# Altium schematic sheet SH2 - MCU.SchDoc: Microcontroller
size B; CheckedBy: Lance Bantoto; Engineer: Christopher Arjune; Organization: UW Robotics; Address1: 200 University Avenue; Address2: Waterloo; Address3: Ontario; Address4: Canada N2L 3G6; Revision: 1; SheetNumber: 2; SheetTotal: 6
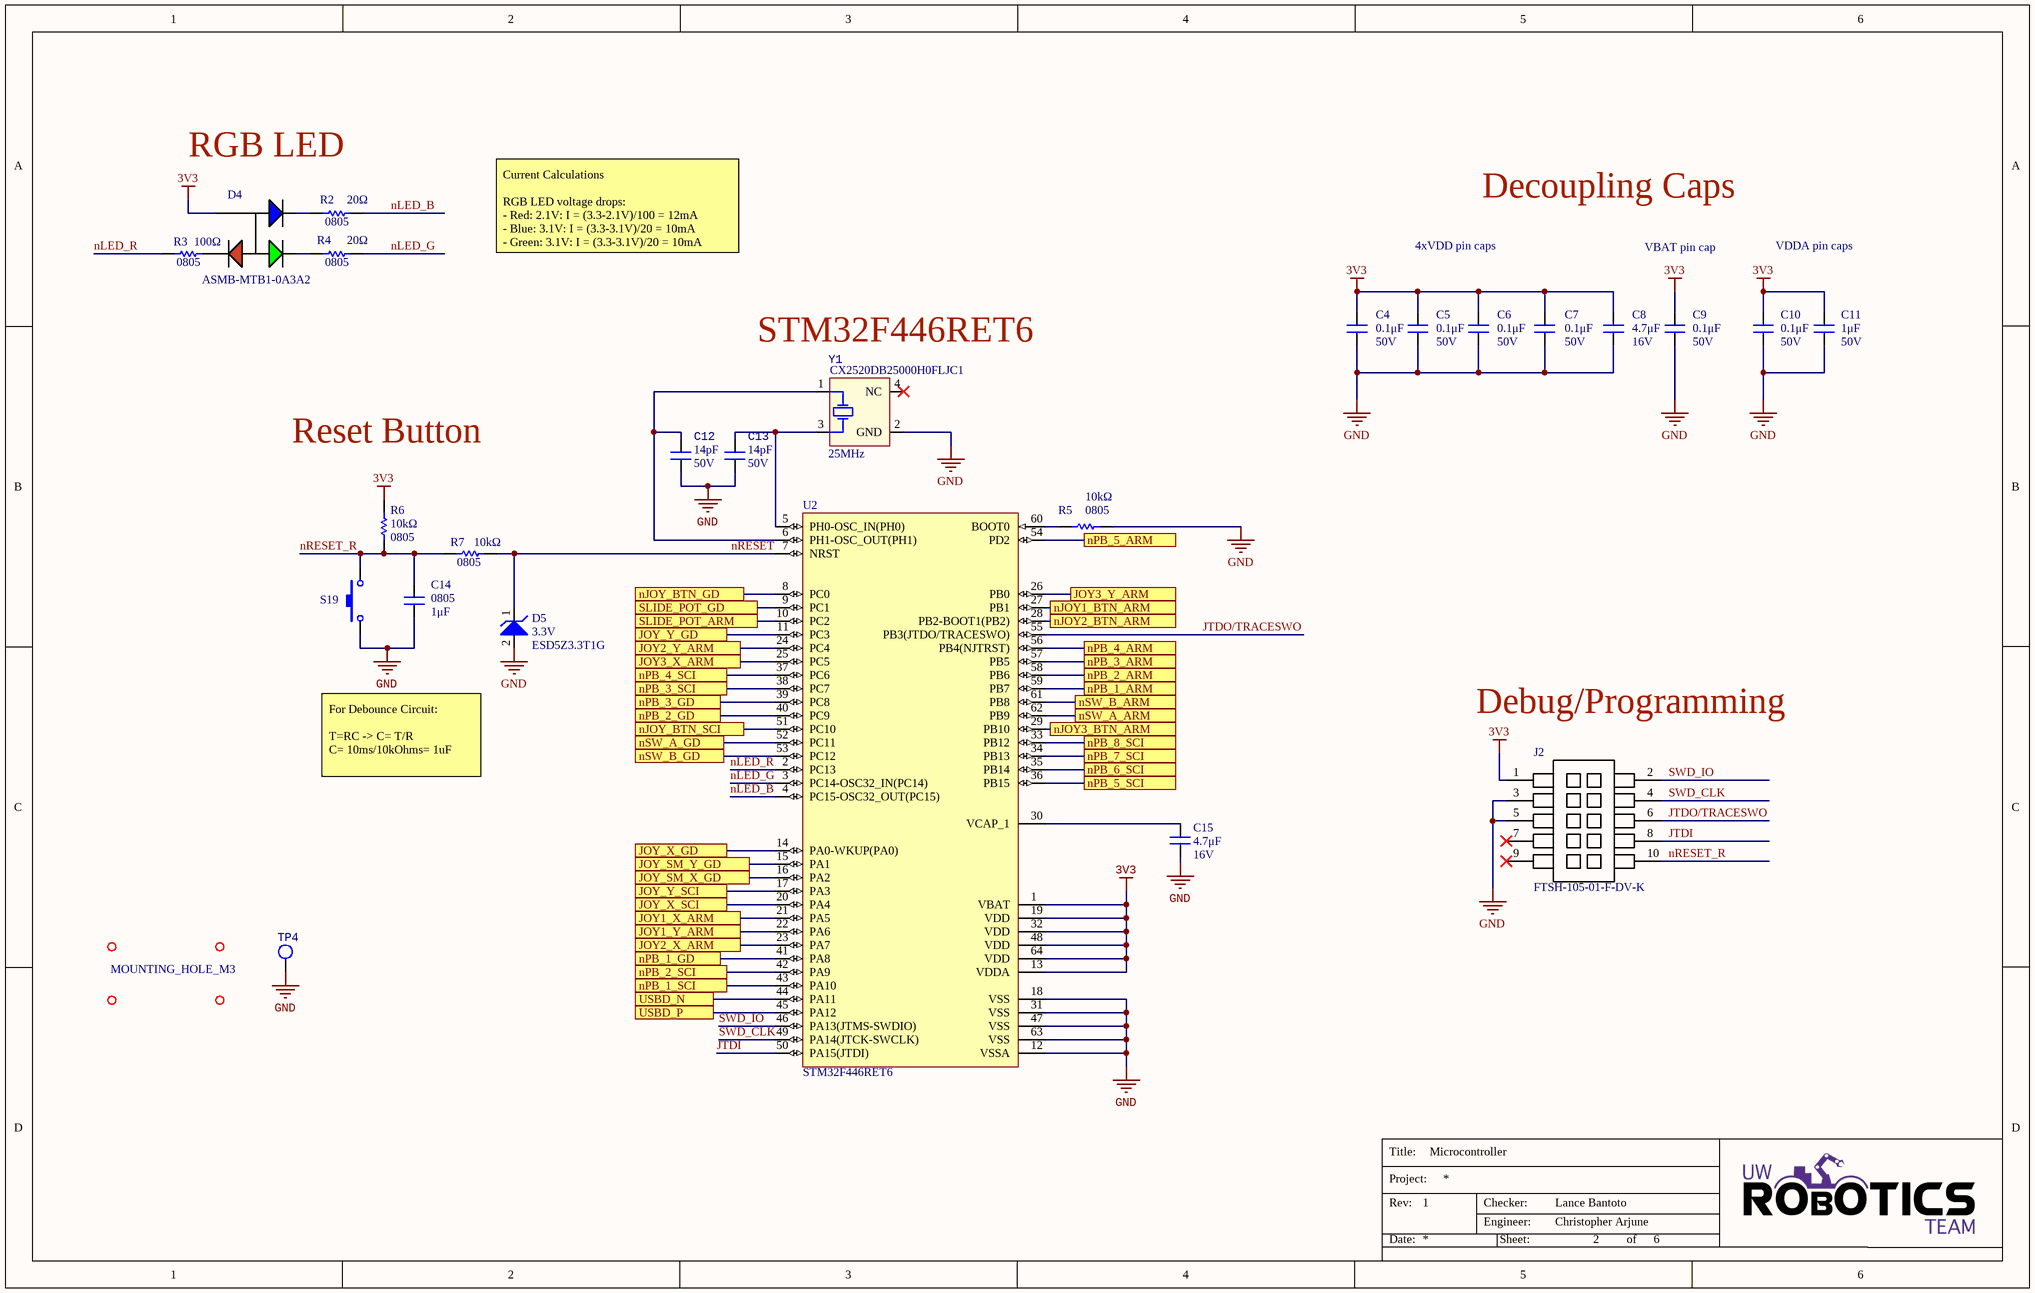
[diagram p0: SH2 - MCU.SchDoc]

## Parts
C4  value 0.1μF  Voltage Rating: 50V  [CAP2012]  (hidden comment: CAP_0.1uF_50V_0805)
C5  value 0.1μF  Voltage Rating: 50V  [CAP2012]  (hidden comment: CAP_0.1uF_50V_0805)
C6  value 0.1μF  Voltage Rating: 50V  [CAP2012]  (hidden comment: CAP_0.1uF_50V_0805)
C7  value 0.1μF  Voltage Rating: 50V  [CAP2012]  (hidden comment: CAP_0.1uF_50V_0805)
C8  value 4.7μF  Voltage Rating: 16V  [CAP2012]  (hidden comment: CAP_4.7uF_16V_0805)
C9  value 0.1μF  Voltage Rating: 50V  [CAP2012]  (hidden comment: CAP_0.1uF_50V_0805)
C10  value 0.1μF  Voltage Rating: 50V  [CAP2012]  (hidden comment: CAP_0.1uF_50V_0805)
C11  value 1μF  Voltage Rating: 50V  [CAP2012]  (hidden comment: CAP_1uF_50V_0805)
C12  value 14pF  Voltage Rating: 50V  [CAP0603]  (hidden comment: CAP_14pF_50V_0603)
C13  value 14pF  Voltage Rating: 50V  [CAP0603]  (hidden comment: CAP_14pF_50V_0603)
C14  value 1μF  Package/Footprint: 0805  [CAP2012]  (hidden comment: CAP_1uF_50V_0805)
C15  value 4.7μF  Voltage Rating: 16V  [CAP2012]  (hidden comment: CAP_4.7uF_16V_0805)
D4  Manufacturer Part Number 1: ASMB-MTB1-0A3A2  [LED_RGB]  (hidden comment: LED_RGB)
D5  Manufacturer Part Number 1: ESD5Z3.3T1G  Voltage - Reverse Standoff (Typ): 3.3V  (hidden comment: TVS_DIODE_UNIDIR_3.3V)
J2  Manufacturer Part Number 1: FTSH-105-01-F-DV-K  [FTSH-105-01-F-DV-K-P-TR]  (hidden comment: CON_PROGRAMMING)
MH1  MOUNTING_HOLE_M3  [MOUNTING_HOLE_3mm]  (value not drawn)  (no BOM)
MH2  MOUNTING_HOLE_M3  [MOUNTING_HOLE_3mm]  (value not drawn)  (no BOM)
MH3  MOUNTING_HOLE_M3  [MOUNTING_HOLE_3mm]  (no BOM)
MH4  MOUNTING_HOLE_M3  [MOUNTING_HOLE_3mm]  (value not drawn)  (no BOM)
R2  value 20Ω  Package/Footprint: 0805  [RESC0805]  (hidden comment: RES_20Ω_0805_1%)
R3  value 100Ω  Package/Footprint: 0805  [RESC0805]  (hidden comment: RES_100Ω_0805_1%)
R4  value 20Ω  Package/Footprint: 0805  [RESC0805]  (hidden comment: RES_20Ω_0805_1%)
R5  value 10kΩ  Package/Footprint: 0805  [RESC0805]  (hidden comment: RES_10kΩ_0805_5%)
R6  value 10kΩ  Package/Footprint: 0805  [RESC0805]  (hidden comment: RES_10kΩ_0805_5%)
R7  value 10kΩ  Package/Footprint: 0805  [RESC0805]  (hidden comment: RES_10kΩ_0805_5%)
S19  SW_TACTILE  [B3U-1000P]  (value not drawn)
TP4  TESTPOINT_LOOP  [TESTPOINT_LOOP]  (value not drawn)
U2  STM32F446RET6  [STM-LQFP64_L]
Y1  Manufacturer Part Number 1: CX2520DB25000H0FLJC1  Frequency: 25MHz  [SOIC254P1016X440-4N]  (hidden comment: CRYSTAL_25MHZ)

## Ports
JOY1_X_ARM, JOY1_Y_ARM, JOY2_X_ARM, JOY2_Y_ARM, JOY3_X_ARM, JOY3_Y_ARM, JOY_SM_X_GD, JOY_SM_Y_GD, JOY_X_GD, JOY_X_SCI, JOY_Y_GD, JOY_Y_SCI, nJOY1_BTN_ARM, nJOY2_BTN_ARM, nJOY3_BTN_ARM, nJOY_BTN_GD, nJOY_BTN_SCI, nPB_1_ARM, nPB_1_GD, nPB_1_SCI, nPB_2_ARM, nPB_2_GD, nPB_2_SCI, nPB_3_ARM, nPB_3_GD, nPB_3_SCI, nPB_4_ARM, nPB_4_SCI, nPB_5_ARM, nPB_5_SCI, nPB_6_SCI, nPB_7_SCI, nPB_8_SCI, nSW_A_ARM, nSW_A_GD, nSW_B_ARM, nSW_B_GD, SLIDE_POT_ARM, SLIDE_POT_GD, USBD_N, USBD_P

## Nets
3V3: C4.2 C5.2 C6.2 C7.2 C8.2 C9.2 C10.2 C11.2 D4.4(COMMON_ANODE) J2.1 R6.2 U2.1(VBAT) U2.13(VDDA) U2.19(VDD) U2.32(VDD) U2.48(VDD) U2.64(VDD)
GND: C4.1 C5.1 C6.1 C7.1 C8.1 C9.1 C10.1 C11.1 C12.1 C13.1 C14.1 C15.1 D5.2 J2.3 J2.5 R5.2 S19.2 TP4.1 U2.12(VSSA) U2.18(VSS) U2.31(VSS) U2.47(VSS) U2.63(VSS) Y1.2(GND)
JOY1_X_ARM: U2.21(PA5) ; port JOY1_X_ARM
JOY1_Y_ARM: U2.22(PA6) ; port JOY1_Y_ARM
JOY2_X_ARM: U2.23(PA7) ; port JOY2_X_ARM
JOY2_Y_ARM: U2.24(PC4) ; port JOY2_Y_ARM
JOY3_X_ARM: U2.25(PC5) ; port JOY3_X_ARM
JOY3_Y_ARM: U2.26(PB0) ; port JOY3_Y_ARM
JOY_SM_X_GD: U2.16(PA2) ; port JOY_SM_X_GD
JOY_SM_Y_GD: U2.15(PA1) ; port JOY_SM_Y_GD
JOY_X_GD: U2.14(PA0-WKUP(PA0)) ; port JOY_X_GD
JOY_X_SCI: U2.20(PA4) ; port JOY_X_SCI
JOY_Y_GD: U2.11(PC3) ; port JOY_Y_GD
JOY_Y_SCI: U2.17(PA3) ; port JOY_Y_SCI
JTDI: J2.8 U2.50(PA15(JTDI))
JTDO/TRACESWO: J2.6 U2.55(PB3(JTDO/TRACESWO))
nJOY1_BTN_ARM: U2.27(PB1) ; port nJOY1_BTN_ARM
nJOY2_BTN_ARM: U2.28(PB2-BOOT1(PB2)) ; port nJOY2_BTN_ARM
nJOY3_BTN_ARM: U2.29(PB10) ; port nJOY3_BTN_ARM
nJOY_BTN_GD: U2.8(PC0) ; port nJOY_BTN_GD
nJOY_BTN_SCI: U2.51(PC10) ; port nJOY_BTN_SCI
nLED_B: R2.2 U2.4(PC15-OSC32_OUT(PC15))
nLED_G: R4.2 U2.3(PC14-OSC32_IN(PC14))
nLED_R: R3.1 U2.2(PC13)
nPB_1_ARM: U2.59(PB7) ; port nPB_1_ARM
nPB_1_GD: U2.41(PA8) ; port nPB_1_GD
nPB_1_SCI: U2.43(PA10) ; port nPB_1_SCI
nPB_2_ARM: U2.58(PB6) ; port nPB_2_ARM
nPB_2_GD: U2.40(PC9) ; port nPB_2_GD
nPB_2_SCI: U2.42(PA9) ; port nPB_2_SCI
nPB_3_ARM: U2.57(PB5) ; port nPB_3_ARM
nPB_3_GD: U2.39(PC8) ; port nPB_3_GD
nPB_3_SCI: U2.38(PC7) ; port nPB_3_SCI
nPB_4_ARM: U2.56(PB4(NJTRST)) ; port nPB_4_ARM
nPB_4_SCI: U2.37(PC6) ; port nPB_4_SCI
nPB_5_ARM: U2.54(PD2) ; port nPB_5_ARM
nPB_5_SCI: U2.36(PB15) ; port nPB_5_SCI
nPB_6_SCI: U2.35(PB14) ; port nPB_6_SCI
nPB_7_SCI: U2.34(PB13) ; port nPB_7_SCI
nPB_8_SCI: U2.33(PB12) ; port nPB_8_SCI
nRESET: D5.1 R7.2 U2.7(NRST)
nRESET_R: C14.2 J2.10 R6.1 R7.1 S19.1
nSW_A_ARM: U2.62(PB9) ; port nSW_A_ARM
nSW_A_GD: U2.52(PC11) ; port nSW_A_GD
nSW_B_ARM: U2.61(PB8) ; port nSW_B_ARM
nSW_B_GD: U2.53(PC12) ; port nSW_B_GD
SLIDE_POT_ARM: U2.10(PC2) ; port SLIDE_POT_ARM
SLIDE_POT_GD: U2.9(PC1) ; port SLIDE_POT_GD
SWD_CLK: J2.4 U2.49(PA14(JTCK-SWCLK))
SWD_IO: J2.2 U2.46(PA13(JTMS-SWDIO))
USBD_N: U2.44(PA11) ; port USBD_N
USBD_P: U2.45(PA12) ; port USBD_P
NetC12_2: C12.2 U2.6(PH1-OSC_OUT(PH1)) Y1.1(HOT)
NetC13_2: C13.2 U2.5(PH0-OSC_IN(PH0)) Y1.3(HOT)
NetC15_2: C15.2 U2.30(VCAP_1)
NetD4_1: D4.1(CATHODE_(RED)) R3.2
NetD4_2: D4.2(CATHODE_(GREEN)) R4.1
NetD4_3: D4.3(CATHODE_(BLUE)) R2.1
NetR5_1: R5.1 U2.60(BOOT0)

Not connected (* = marked no-connect by the designer): J2 7* 9*; Y1 4(NC)*

## Notes on the sheet
- RGB LED
- Decoupling Caps
- Current Calculations
  RGB LED voltage drops:
  - Red: 2.1V: I = (3.3-2.1V)/100 = 12mA
  - Blue: 3.1V: I = (3.3-3.1V)/20 = 10mA
  - Green: 3.1V: I = (3.3-3.1V)/20 = 10mA
- 4xVDD pin caps
- VBAT pin cap
- VDDA pin caps
- (near Y1) STM32F446RET6
- Reset Button
- For Debounce Circuit:
  T=RC -> C= T/R
  C= 10ms/10kOhms= 1uF
- Debug/Programming
- Title:
- Project:
- Date:
- Rev:
- Checker:
- Engineer:
- Sheet:
- of

## Library data of the parts
C4-C7 C9 C10 = CAP_0.1uF_50V_0805: CAP CER 0.1UF 50V X7R 0805; Manufacturer 1: Murata Electronics; Manufacturer Part Number 1: GCM21BR71H104KA37K; Package/Footprint: 0805; Supplier 1: Digi-Key; Supplier Part Number 1: 490-8049-1-ND; Mounting Type: SMD; LCSC Part #: C49678; Dielectric: X7R
C8 C15 = CAP_4.7uF_16V_0805: CAP CER 4.7UF 16V X5R 0805; Manufacturer 1: Samsung Electro-Mechanics; Manufacturer Part Number 1: CL21A475KOFNNNE; Package/Footprint: 0805; Supplier 1: Digi-Key; Supplier Part Number 1: 1276-1065-1-ND; Mounting Type: SMD; LCSC Part #: C1779; Dielectric: X5R
C11 = CAP_1uF_50V_0805: CAP CER 1UF 50V X7R 0805; Manufacturer 1: Samsung Electro-Mechanics; Manufacturer Part Number 1: CL21B105KBFNNNG; Package/Footprint: 0805; Supplier 1: Digi-Key; Supplier Part Number 1: 1276-6470-1-ND; Mounting Type: SMD; LCSC Part #: C28323
C12 C13 = CAP_14pF_50V_0603: CAP CER 14PF 50V C0G/NP0 0603; Manufacturer 1: Samsung; Manufacturer Part Number 1: CL10C140JB8NNNC; Dielectric: C0G; Package/Footprint: 0603; Supplier Part Number 1: 1276-2187-1-ND; Supplier 1: Digi-Key; Mounting Type: SMD
C14 = CAP_1uF_50V_0805: CAP CER 1UF 50V X7R 0805; Manufacturer 1: Samsung Electro-Mechanics; Manufacturer Part Number 1: CL21B105KBFNNNG; Supplier 1: Digi-Key; Supplier Part Number 1: 1276-6470-1-ND; Voltage Rating: 50V; Mounting Type: SMD; LCSC Part #: C28323
D4 = LED_RGB: LED RGB DIFFUSED 4PLCC SMD; Manufacturer 1: Broadcom; Color: Blue,Green,Red; Lens Color: White; Viewing Angle: 115°; Lens Style: Round; Luminous Intensity: 350mcd; Dominant Wavelength: 470nm; Forward Voltage: 3.1V; Test Current: 20mA; Package/Footprint: 4-PLCC; Supplier 1: Digi-Key; Number of Pins: 4; Lens Transparency: Diffused; Supplier Part Number 1: 516-3280-1-ND; Mounting Type: SMD
D5 = TVS_DIODE_UNIDIR_3.3V: TVS DIODE 3.3V 14.1V SOD523; Manufacturer 1: ON Semiconductor; Package/Footprint: SOD-523; Voltage - Breakdown (Min): 5V; Supplier 1: Digi-Key; Supplier Part Number 1: ESD5Z3.3T1GOSCT-ND; Mounting Type: SMD; LCSC Part #: C61148; Voltage - Clamping (Max) @ Ipp: 14.1V
J2 = CON_PROGRAMMING: CONN HEADER SMD 10POS 1.27MM; Manufacturer 1: Samtec; Supplier 1: Digi-Key; Pitch: 1.27mm; Supplier Part Number 1: SAM8796-ND; Mounting Type: SMD; Package/Footprint: SMD
R2 R4 = RES_20Ω_0805_1%: RES 20 OHM 1% 1/8W 0805; Manufacturer 1: Yageo; Manufacturer Part Number 1: RC0805FR-0720RL; Supplier 1: Digi-Key; Supplier Part Number 1: 311-20.0CRCT-ND; Mounting Type: SMD; LCSC Part #: C17581
R3 = RES_100Ω_0805_1%: RES 100 OHM 1% 1/8W 0805; Manufacturer 1: Vishay Dale; Manufacturer Part Number 1: CRCW0805100RFKEA; Supplier 1: Digi-Key; Supplier Part Number 1: 541-100CCT-ND; Mounting Type: SMD; LCSC Part #: C1790
R5-R7 = RES_10kΩ_0805_5%: RES 10K OHM 5% 1/8W 0805; Manufacturer 1: Panasonic Electronic Components; Manufacturer Part Number 1: ERJ-6GEYJ103V; Supplier 1: Digi-Key; Supplier Part Number 1: P10KACT-ND; LCSC Part #: C17414; Mounting Type: SMD
S19 = SW_TACTILE: SWITCH TACTILE SPST-NO 0.05A 12V; Manufacturer 1: Omron Electronics Inc-EMC Div; Package/Footprint: SMD; Manufacturer Part Number 1: B3U-1000P; Supplier 1: Digi-Key; Supplier Part Number 1: SW1020CT-ND; Mounting Type: SMD
TP4 = TESTPOINT_LOOP: TESTPOINT THRUHOLE; Manufacturer Part Number 1: 5002; Manufacturer 1: Keystone Electronics; Package/Footprint: TH; Supplier Part Number 1: 36-5002-ND; Supplier 1: Digi-Key; Mounting Type: TH
U2 = MCU_STM32F446RET6: ARM Cortex-M4 32-bit MCU+FPU, 512 KB Flash, 128 KB Internal RAM, 50 I/Os, 64-Pin LQFP, -40 to 85 degC, Tray; I/Os (High Current): 50; Supply Voltage(Vcc) min (V): 1.7; Operating Frequency(F) (Processor speed) (MHz): 180; D/A Converter: 2; Internal RAM Size (kB): 128; FLASH Size (Prog) (kB): 512; Core: ARM Cortex-M4; ComponentLink1Description: Manufacturer URL; Package Reference: 64-Pin Low-profile Quad Flat Package, Body 10 x 10 mm, Pitch 0.5 mm; ComponentLink2URL: http://www.st.com/st-web-ui/static/active/en/resource/technical/document/datasheet/DM00141306.pdf; Packing: Tray; DatasheetVersion: Rev. 6; ComponentLink1URL: http://www.st.com/; ComponentLink2Description: Datasheet; Package Description: LQFP64; Mounting Technology: Surface Mount; Supplier Part Number 1: 497-15376-ND; Supplier 1: Digi-Key
Y1 = CRYSTAL_25MHZ: CRYSTAL 25.0000MHZ 12PF SMD; Manufacturer 1: Kyocera AVX; Supplier 1: Digi-Key; Supplier Part Number 1: 1253-1724-1-ND; Load Capacitance: 12pF; Mounting Type: SMD; Package/Footprint: SMD